# EAGLE design BaseBoard_2x5 (EAGLE 7.1.0)
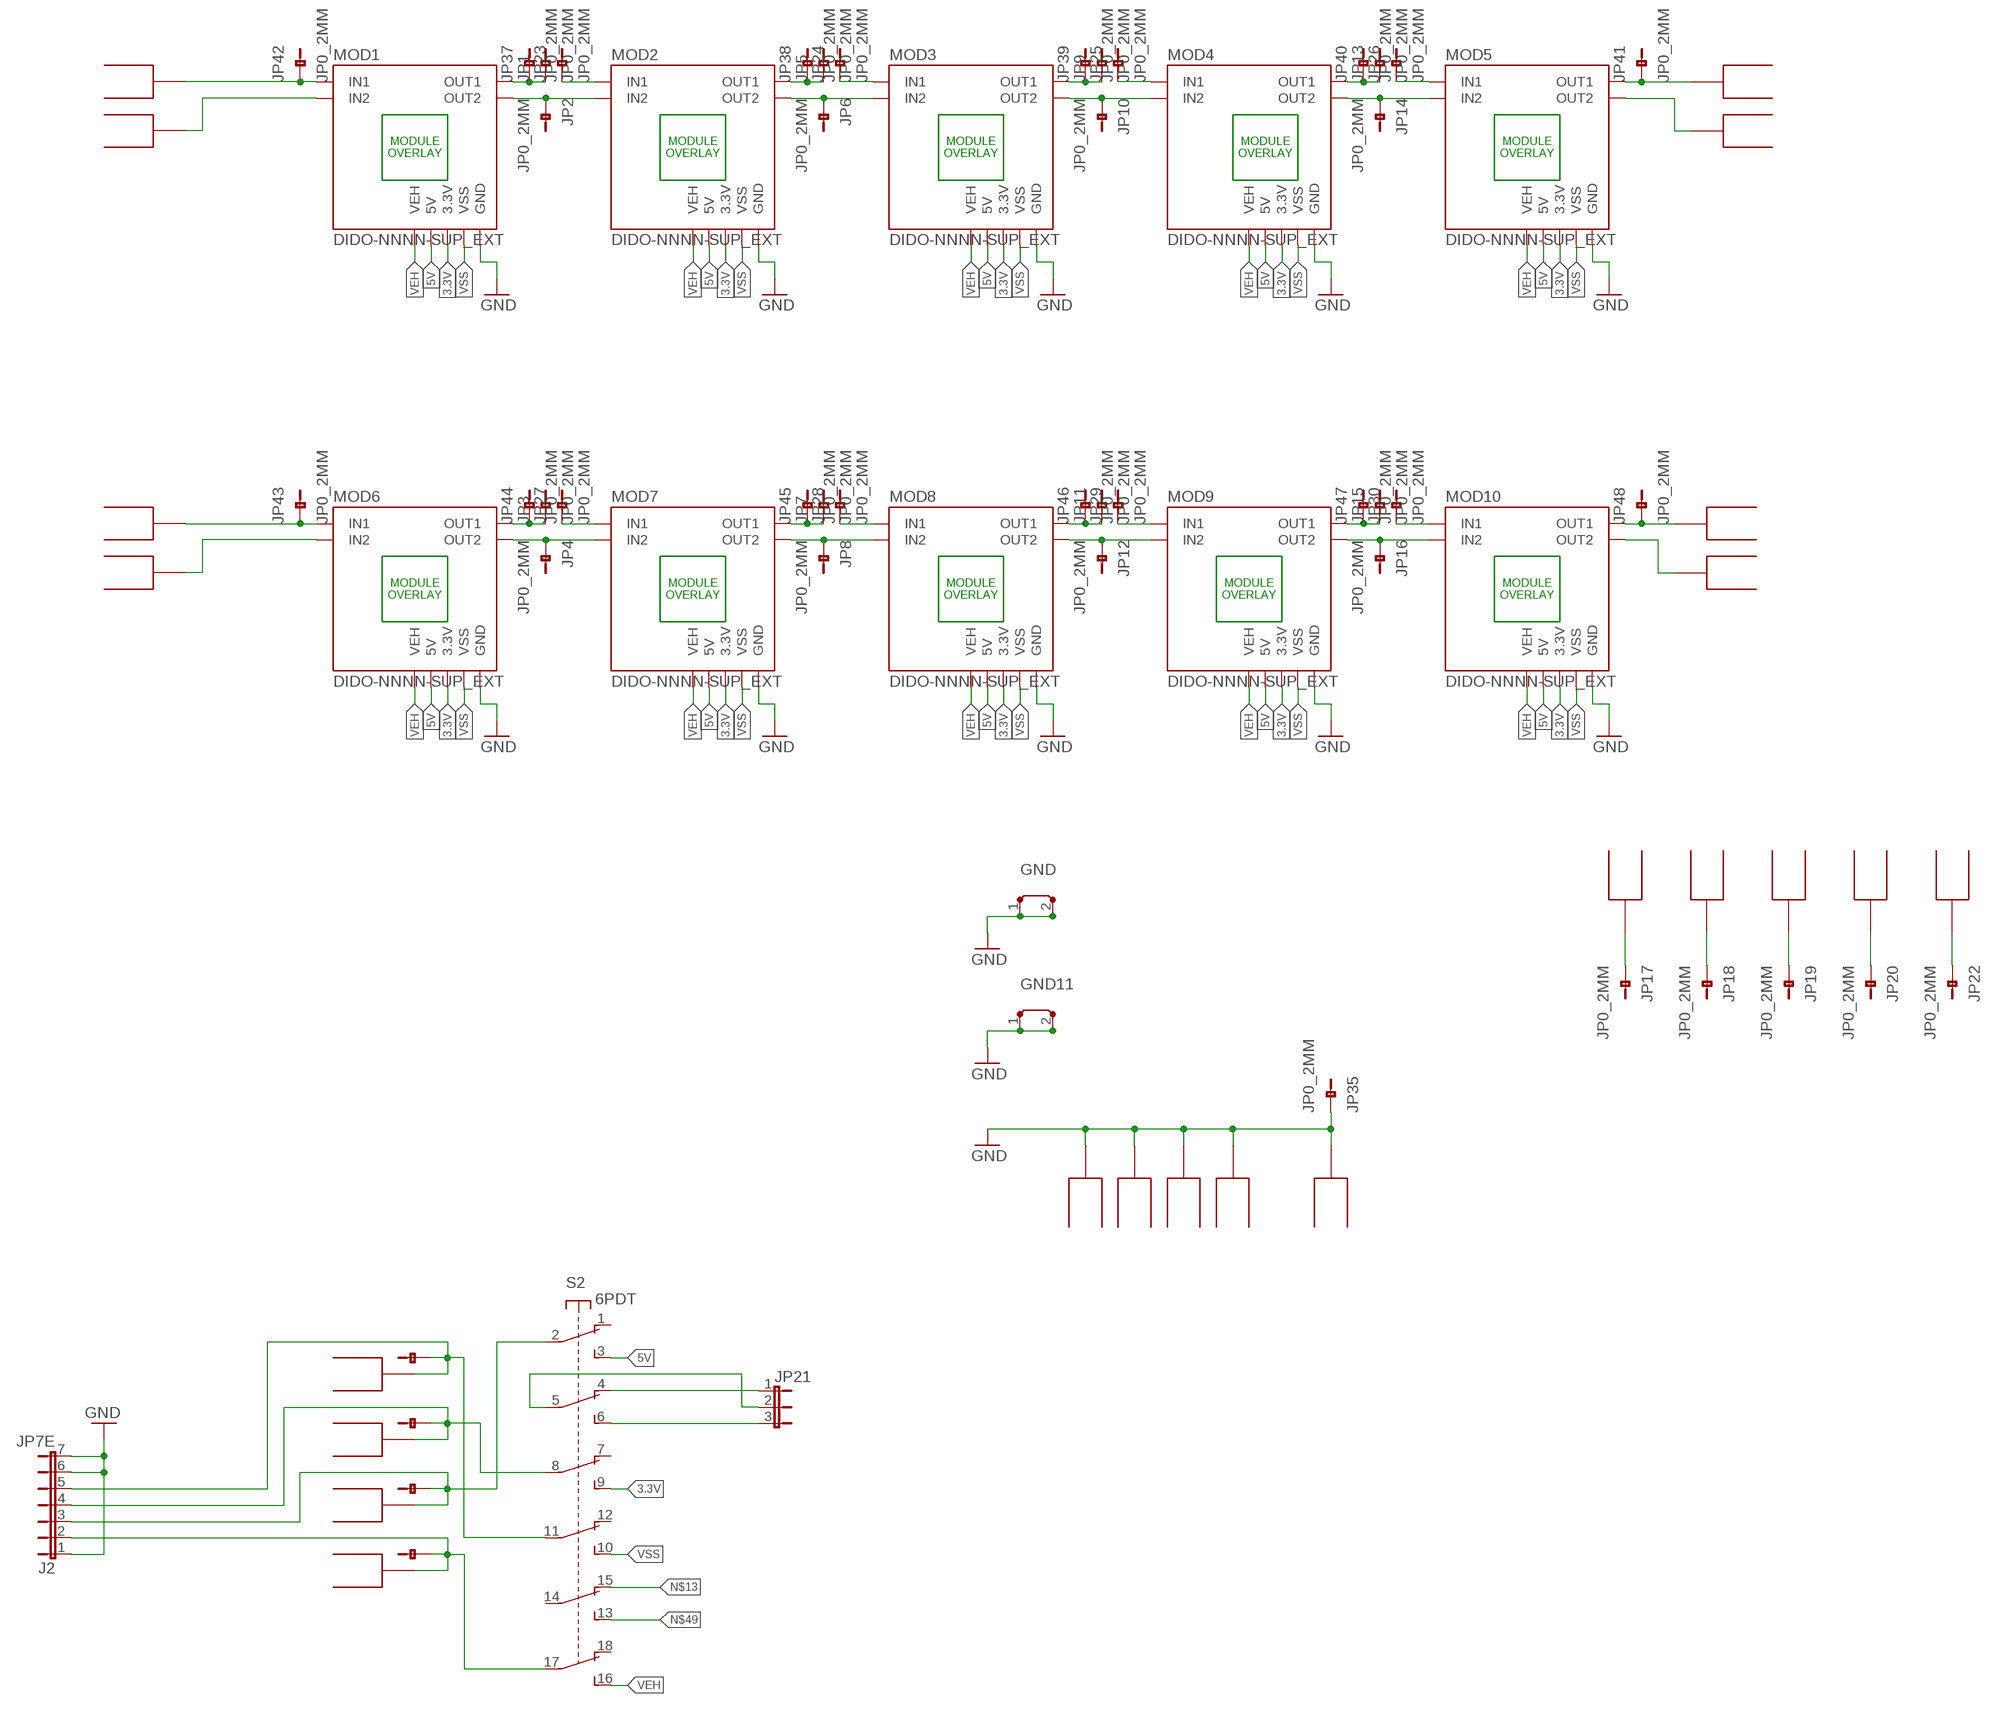
[diagram p0: schematic, sheet 1]

## Parts
GND  TE4/2  [TE4/2]
GND11  TE4/2  [TE4/2]
J2  JP7E  [JP7]
JP1  JP0_2MM  [JP0-2MM]
JP2  JP0_2MM  [JP0-2MM]
JP3  JP0_2MM  [JP0-2MM]
JP4  JP0_2MM  [JP0-2MM]
JP5  JP0_2MM  [JP0-2MM]
JP6  JP0_2MM  [JP0-2MM]
JP7  JP0_2MM  [JP0-2MM]
JP8  JP0_2MM  [JP0-2MM]
JP9  JP0_2MM  [JP0-2MM]
JP10  JP0_2MM  [JP0-2MM]
JP11  JP0_2MM  [JP0-2MM]
JP12  JP0_2MM  [JP0-2MM]
JP13  JP0_2MM  [JP0-2MM]
JP14  JP0_2MM  [JP0-2MM]
JP15  JP0_2MM  [JP0-2MM]
JP16  JP0_2MM  [JP0-2MM]
JP17  JP0_2MM  [JP0-2MM]
JP18  JP0_2MM  [JP0-2MM]
JP19  JP0_2MM  [JP0-2MM]
JP20  JP0_2MM  [JP0-2MM]
JP21  JP2E  [JP2]
JP22  JP0_2MM  [JP0-2MM]
JP23  JP0_2MM  [JP0-2MM]
JP24  JP0_2MM  [JP0-2MM]
JP25  JP0_2MM  [JP0-2MM]
JP26  JP0_2MM  [JP0-2MM]
JP27  JP0_2MM  [JP0-2MM]
JP28  JP0_2MM  [JP0-2MM]
JP29  JP0_2MM  [JP0-2MM]
JP30  JP0_2MM  [JP0-2MM]
JP35  JP0_2MM  [JP0-2MM]
JP37  JP0_2MM  [JP0-2MM]
JP38  JP0_2MM  [JP0-2MM]
JP39  JP0_2MM  [JP0-2MM]
JP40  JP0_2MM  [JP0-2MM]
JP41  JP0_2MM  [JP0-2MM]
JP42  JP0_2MM  [JP0-2MM]
JP43  JP0_2MM  [JP0-2MM]
JP44  JP0_2MM  [JP0-2MM]
JP45  JP0_2MM  [JP0-2MM]
JP46  JP0_2MM  [JP0-2MM]
JP47  JP0_2MM  [JP0-2MM]
JP48  JP0_2MM  [JP0-2MM]
JP53  JP0_2MM  [JP0-2MM]
JP54  JP0_2MM  [JP0-2MM]
JP55  JP0_2MM  [JP0-2MM]
JP56  JP0_2MM  [JP0-2MM]
MOD1  DIDO-NNNN-SUP_EXT  [DIDO-NNNN-SUP_EXT]
MOD2  DIDO-NNNN-SUP_EXT  [DIDO-NNNN-SUP_EXT]
MOD3  DIDO-NNNN-SUP_EXT  [DIDO-NNNN-SUP_EXT]
MOD4  DIDO-NNNN-SUP_EXT  [DIDO-NNNN-SUP_EXT]
MOD5  DIDO-NNNN-SUP_EXT  [DIDO-NNNN-SUP_EXT]
MOD6  DIDO-NNNN-SUP_EXT  [DIDO-NNNN-SUP_EXT]
MOD7  DIDO-NNNN-SUP_EXT  [DIDO-NNNN-SUP_EXT]
MOD8  DIDO-NNNN-SUP_EXT  [DIDO-NNNN-SUP_EXT]
MOD9  DIDO-NNNN-SUP_EXT  [DIDO-NNNN-SUP_EXT]
MOD10  DIDO-NNNN-SUP_EXT  [DIDO-NNNN-SUP_EXT]
MODULE1  MODULE_OVERLAY  [MODULE_OVERLAY]
MODULE2  MODULE_OVERLAY  [MODULE_OVERLAY]
MODULE3  MODULE_OVERLAY  [MODULE_OVERLAY]
MODULE4  MODULE_OVERLAY  [MODULE_OVERLAY]
MODULE5  MODULE_OVERLAY  [MODULE_OVERLAY]
MODULE6  MODULE_OVERLAY  [MODULE_OVERLAY]
MODULE7  MODULE_OVERLAY  [MODULE_OVERLAY]
MODULE8  MODULE_OVERLAY  [MODULE_OVERLAY]
MODULE9  MODULE_OVERLAY  [MODULE_OVERLAY]
MODULE10  MODULE_OVERLAY  [MODULE_OVERLAY]
P1  BANANA-PLUGROUND  [6MM-PAD-ROUND]
P2  BANANA-PLUGROUND  [6MM-PAD-ROUND]
P3  BANANA-PLUGROUND  [6MM-PAD-ROUND]
P4  BANANA-PLUGROUND  [6MM-PAD-ROUND]
P5  BANANA-PLUGROUND  [6MM-PAD-ROUND]
P6  BANANA-PLUGROUND  [6MM-PAD-ROUND]
P10  BANANA-PLUGROUND  [6MM-PAD-ROUND]
P11  BANANA-PLUGROUND  [6MM-PAD-ROUND]
P12  BANANA-PLUGROUND  [6MM-PAD-ROUND]
P13  BANANA-PLUGROUND  [6MM-PAD-ROUND]
P14  BANANA-PLUGROUND  [6MM-PAD-ROUND]
P15  BANANA-PLUGROUND  [6MM-PAD-ROUND]
P16  BANANA-PLUGROUND  [6MM-PAD-ROUND]
P18  BANANA-PLUGROUND  [6MM-PAD-ROUND]
P19  BANANA-PLUGROUND  [6MM-PAD-ROUND]
P20  BANANA-PLUGROUND  [6MM-PAD-ROUND]
P21  BANANA-PLUGROUND  [6MM-PAD-ROUND]
P22  BANANA-PLUGROUND  [6MM-PAD-ROUND]
P23  BANANA-PLUGROUND  [6MM-PAD-ROUND]
P24  BANANA-PLUGROUND  [6MM-PAD-ROUND]
P27  BANANA-PLUGROUND  [6MM-PAD-ROUND]
P28  BANANA-PLUGROUND  [6MM-PAD-ROUND]
S2  6PDT  [DIL18]

## Nets
3.3V: MOD1.3.3V MOD2.3.3V MOD3.3.3V MOD4.3.3V MOD5.3.3V MOD6.3.3V MOD7.3.3V MOD8.3.3V MOD9.3.3V MOD10.3.3V S2.9(S3)
5V: MOD1.5V MOD2.5V MOD3.5V MOD4.5V MOD5.5V MOD6.5V MOD7.5V MOD8.5V MOD9.5V MOD10.5V S2.3(S1)
GND: GND11.1(P) GND11.2(P) GND.1(P) GND.2(P) J2.1 J2.6 J2.7 JP35.1 MOD1.GND1(GND) MOD1.GND2(GND) MOD1.GND3(GND) MOD1.GND4(GND) MOD2.GND1(GND) MOD2.GND2(GND) MOD2.GND3(GND) MOD2.GND4(GND) MOD3.GND1(GND) MOD3.GND2(GND) MOD3.GND3(GND) MOD3.GND4(GND) MOD4.GND1(GND) MOD4.GND2(GND) MOD4.GND3(GND) MOD4.GND4(GND) MOD5.GND1(GND) MOD5.GND2(GND) MOD5.GND3(GND) MOD5.GND4(GND) MOD6.GND1(GND) MOD6.GND2(GND) MOD6.GND3(GND) MOD6.GND4(GND) MOD7.GND1(GND) MOD7.GND2(GND) MOD7.GND3(GND) MOD7.GND4(GND) MOD8.GND1(GND) MOD8.GND2(GND) MOD8.GND3(GND) MOD8.GND4(GND) MOD9.GND1(GND) MOD9.GND2(GND) MOD9.GND3(GND) MOD9.GND4(GND) MOD10.GND1(GND) MOD10.GND2(GND) MOD10.GND3(GND) MOD10.GND4(GND) P5.1 P14.1 P15.1 P16.1 P18.1
N$1: MOD5.OUT2_1(OUT2) MOD5.OUT2_2(OUT2) MOD5.OUT2_3(OUT2) MOD5.OUT2_4(OUT2) P11.1
N$2: JP42.1 MOD1.IN1 MOD1.IN2(IN1) MOD1.IN3(IN1) MOD1.IN4(IN1) P1.1
N$3: MOD10.OUT2_1(OUT2) MOD10.OUT2_2(OUT2) MOD10.OUT2_3(OUT2) MOD10.OUT2_4(OUT2) P13.1
N$4: MOD1.IN2_1(IN2) MOD1.IN2_2(IN2) MOD1.IN2_3(IN2) MOD1.IN2_4(IN2) P2.1
N$5: JP1.1 JP37.1 MOD1.OUT1 MOD1.OUT2(OUT1) MOD1.OUT3(OUT1) MOD1.OUT4(OUT1)
N$6: JP5.1 JP38.1 MOD2.OUT1 MOD2.OUT2(OUT1) MOD2.OUT3(OUT1) MOD2.OUT4(OUT1)
N$7: JP2.1 MOD1.OUT2_1(OUT2) MOD1.OUT2_2(OUT2) MOD1.OUT2_3(OUT2) MOD1.OUT2_4(OUT2) MOD2.IN2_1(IN2) MOD2.IN2_2(IN2) MOD2.IN2_3(IN2) MOD2.IN2_4(IN2)
N$8: JP17.1 P19.1
N$9: JP9.1 JP39.1 MOD3.OUT1 MOD3.OUT2(OUT1) MOD3.OUT3(OUT1) MOD3.OUT4(OUT1)
N$10: JP41.1 MOD5.OUT1 MOD5.OUT2(OUT1) MOD5.OUT3(OUT1) MOD5.OUT4(OUT1) P10.1
N$11: JP6.1 MOD2.OUT2_1(OUT2) MOD2.OUT2_2(OUT2) MOD2.OUT2_3(OUT2) MOD2.OUT2_4(OUT2) MOD3.IN2_1(IN2) MOD3.IN2_2(IN2) MOD3.IN2_3(IN2) MOD3.IN2_4(IN2)
N$12: JP18.1 P20.1
N$13: J2.3 JP54.1 P27.1 S2.2(P1) S2.15(O5)
N$14: JP23.1 MOD2.IN1 MOD2.IN2(IN1) MOD2.IN3(IN1) MOD2.IN4(IN1)
N$15: JP10.1 MOD3.OUT2_1(OUT2) MOD3.OUT2_2(OUT2) MOD3.OUT2_3(OUT2) MOD3.OUT2_4(OUT2) MOD4.IN2_1(IN2) MOD4.IN2_2(IN2) MOD4.IN2_3(IN2) MOD4.IN2_4(IN2)
N$16: JP19.1 P21.1
N$17: JP48.1 MOD10.OUT1 MOD10.OUT2(OUT1) MOD10.OUT3(OUT1) MOD10.OUT4(OUT1) P12.1
N$18: JP16.1 MOD9.OUT2_1(OUT2) MOD9.OUT2_2(OUT2) MOD9.OUT2_3(OUT2) MOD9.OUT2_4(OUT2) MOD10.IN2_1(IN2) MOD10.IN2_2(IN2) MOD10.IN2_3(IN2) MOD10.IN2_4(IN2)
N$19: JP14.1 MOD4.OUT2_1(OUT2) MOD4.OUT2_2(OUT2) MOD4.OUT2_3(OUT2) MOD4.OUT2_4(OUT2) MOD5.IN2_1(IN2) MOD5.IN2_2(IN2) MOD5.IN2_3(IN2) MOD5.IN2_4(IN2)
N$20: JP13.1 JP40.1 MOD4.OUT1 MOD4.OUT2(OUT1) MOD4.OUT3(OUT1) MOD4.OUT4(OUT1)
N$21: JP20.1 P22.1
N$22: JP21.3 S2.6(S2)
N$23: JP21.1 S2.4(O2)
N$24: JP21.2 S2.5(P2)
N$25: MOD6.IN2_1(IN2) MOD6.IN2_2(IN2) MOD6.IN2_3(IN2) MOD6.IN2_4(IN2) P4.1
N$26: JP4.1 MOD6.OUT2_1(OUT2) MOD6.OUT2_2(OUT2) MOD6.OUT2_3(OUT2) MOD6.OUT2_4(OUT2) MOD7.IN2_1(IN2) MOD7.IN2_2(IN2) MOD7.IN2_3(IN2) MOD7.IN2_4(IN2)
N$27: JP26.1 MOD5.IN1 MOD5.IN2(IN1) MOD5.IN3(IN1) MOD5.IN4(IN1)
N$28: JP22.1 P6.1
N$29: JP25.1 MOD4.IN1 MOD4.IN2(IN1) MOD4.IN3(IN1) MOD4.IN4(IN1)
N$30: JP8.1 MOD7.OUT2_1(OUT2) MOD7.OUT2_2(OUT2) MOD7.OUT2_3(OUT2) MOD7.OUT2_4(OUT2) MOD8.IN2_1(IN2) MOD8.IN2_2(IN2) MOD8.IN2_3(IN2) MOD8.IN2_4(IN2)
N$31: JP24.1 MOD3.IN1 MOD3.IN2(IN1) MOD3.IN3(IN1) MOD3.IN4(IN1)
N$32: JP12.1 MOD8.OUT2_1(OUT2) MOD8.OUT2_2(OUT2) MOD8.OUT2_3(OUT2) MOD8.OUT2_4(OUT2) MOD9.IN2_1(IN2) MOD9.IN2_2(IN2) MOD9.IN2_3(IN2) MOD9.IN2_4(IN2)
N$36: J2.2 JP53.1 P28.1 S2.17(P6)
N$39: JP27.1 MOD7.IN1 MOD7.IN2(IN1) MOD7.IN3(IN1) MOD7.IN4(IN1)
N$40: JP28.1 MOD8.IN1 MOD8.IN2(IN1) MOD8.IN3(IN1) MOD8.IN4(IN1)
N$41: JP29.1 MOD9.IN1 MOD9.IN2(IN1) MOD9.IN3(IN1) MOD9.IN4(IN1)
N$42: JP30.1 MOD10.IN1 MOD10.IN2(IN1) MOD10.IN3(IN1) MOD10.IN4(IN1)
N$43: JP43.1 MOD6.IN1 MOD6.IN2(IN1) MOD6.IN3(IN1) MOD6.IN4(IN1) P3.1
N$44: JP3.1 JP44.1 MOD6.OUT1 MOD6.OUT2(OUT1) MOD6.OUT3(OUT1) MOD6.OUT4(OUT1)
N$45: JP7.1 JP45.1 MOD7.OUT1 MOD7.OUT2(OUT1) MOD7.OUT3(OUT1) MOD7.OUT4(OUT1)
N$46: JP11.1 JP46.1 MOD8.OUT1 MOD8.OUT2(OUT1) MOD8.OUT3(OUT1) MOD8.OUT4(OUT1)
N$47: JP15.1 JP47.1 MOD9.OUT1 MOD9.OUT2(OUT1) MOD9.OUT3(OUT1) MOD9.OUT4(OUT1)
N$49: J2.4 JP55.1 P24.1 S2.8(P3) S2.13(S5)
N$50: J2.5 JP56.1 P23.1 S2.11(P4)
VEH: MOD1.VEH MOD2.VEH MOD3.VEH MOD4.VEH MOD5.VEH MOD6.VEH MOD7.VEH MOD8.VEH MOD9.VEH MOD10.VEH S2.16(S6)
VSS: MOD1.VSS MOD2.VSS MOD3.VSS MOD4.VSS MOD5.VSS MOD6.VSS MOD7.VSS MOD8.VSS MOD9.VSS MOD10.VSS S2.10(S4)
Unconnected: S2.1(O1) S2.7(O3) S2.12(O4) S2.14(P5) S2.18(O6)

## Library data of the parts
GND GND11 = busbar:TE4/2: BUS BAR 2 connections, grid 4 TE
J2 = Jumper_mod:JP7E
JP1-JP20 JP22-JP30 JP35 JP37-JP48 JP53-JP56 = Jumper_mod:JP0_2MM
JP21 = Jumper_mod:JP2E: JUMPER
MOD1-MOD10 = AllModules:DIDO-NNNN-SUP_EXT
MODULE1-MODULE10 = AllModules:MODULE_OVERLAY
P1-P6 P10-P16 P18-P24 P27 P28 = banana-plug-4mm:BANANA-PLUG
S2 = 6PDT:6PDT

## Board
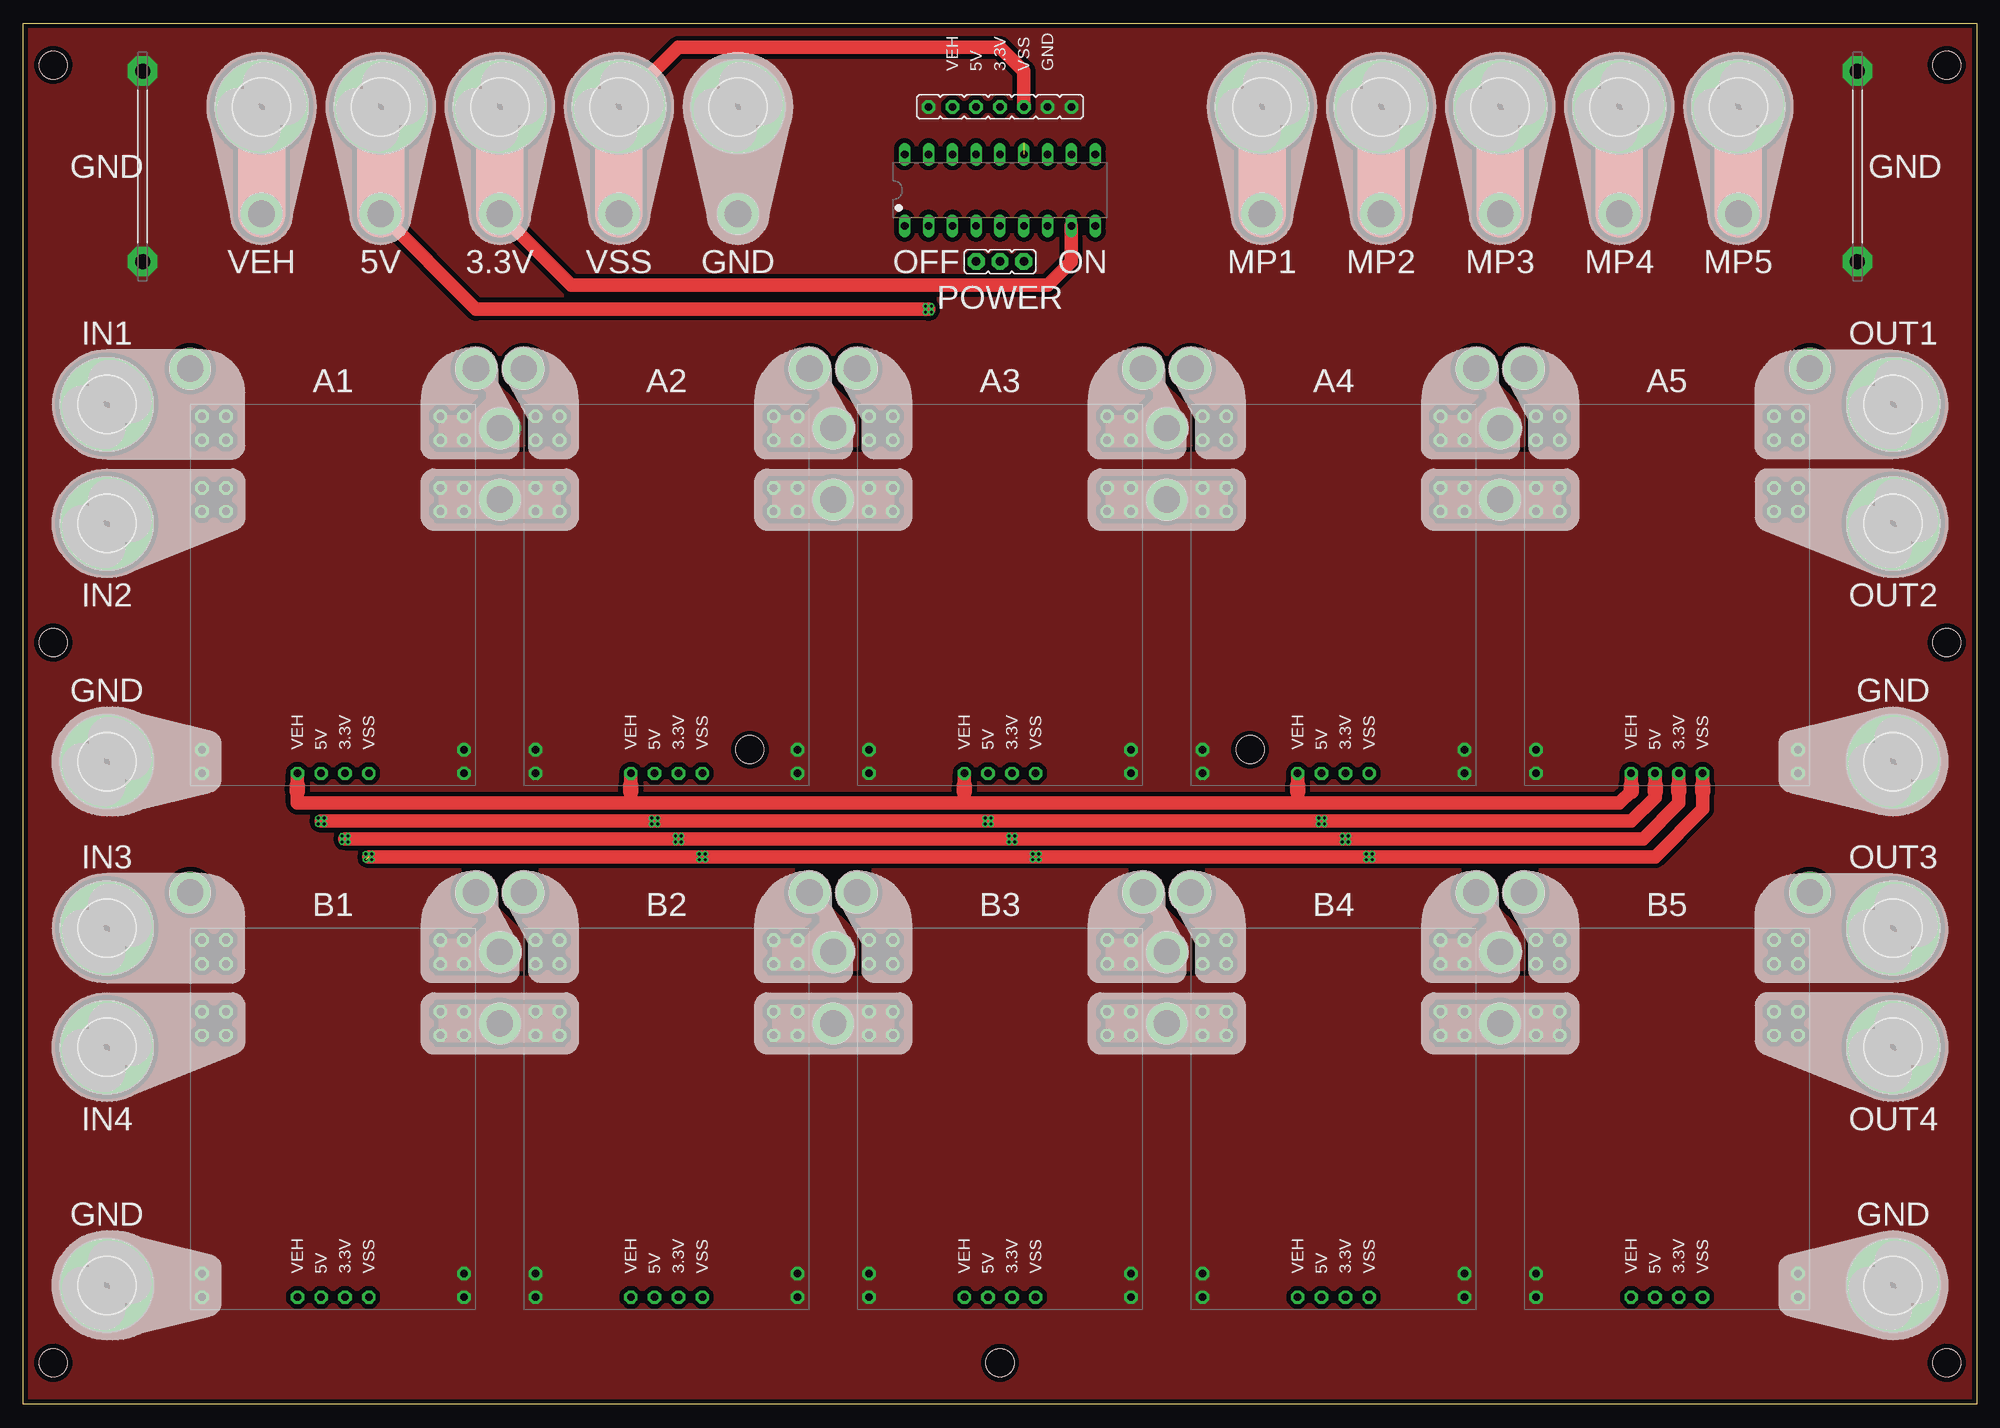
[diagram p1: board, top side]
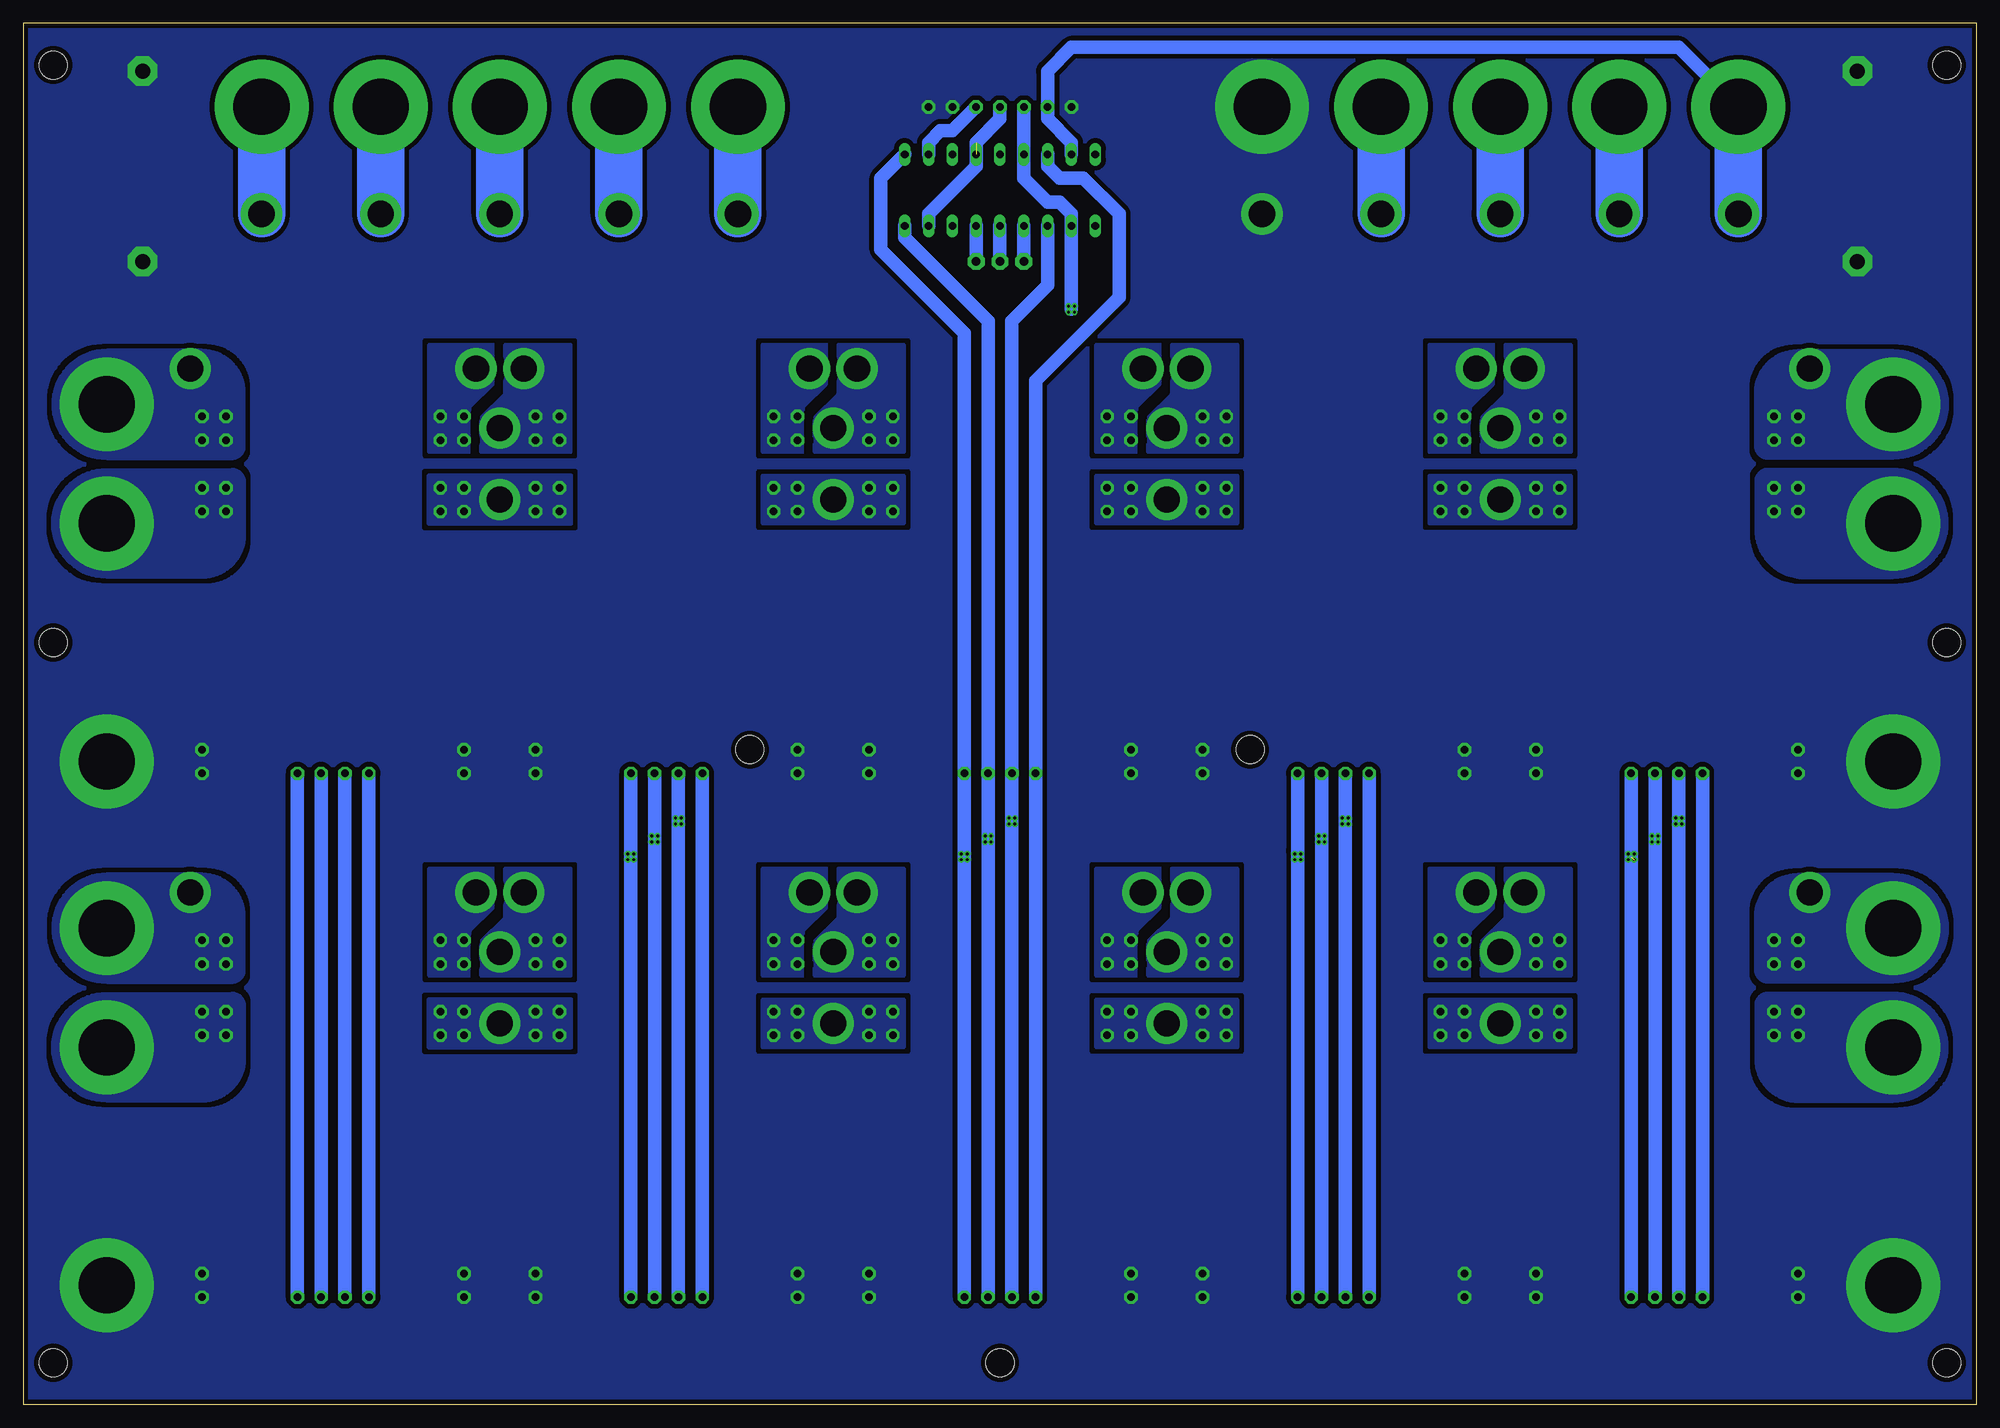
[diagram p2: board, bottom side, seen from below]

Size 208.28 x 147.32 mm. Coordinates in mm from the lower left corner, seen from the top.
Outline: 0,147.32 208.28,147.32 208.28,0 0,0 0,147.32
Copper layers (1*16): Top 0.035mm / dielectric 1.5mm / Bottom 0.035mm
Design rules "Aetzwerk-DRC 2 Lagen 35µm Cu *": minimum track width 6mil, minimum drill 12mil, track to track 6mil, track to pad 6mil, pad to pad 6mil, via to via 6mil, smd to smd 6mil, copper to edge 20mil, drill to drill 8mil, minimum pad ring 8mil, minimum via ring 6mil, stop-mask expansion 3mil, vias tented up to drill 20mil, thermal gap 8mil
Holes 3 mm at 3.17,142.88 205.1,142.88 3.17,4.44 205.1,4.44 77.47,69.85 130.81,69.85 205.1,81.28 3.17,81.28 104.14,4.44

### Footprints (pad centres in the part's own frame; a part is rotated, then mirrored left to right if it is on the bottom)
TE4/2 = drill 1.6 pad 3.15 octagon: 1 -10.16,0; 2 10.16,0
JP7 = drill 0.8 pad 1.44 octagon: 1 -5.08,0; 2 -2.54,0; 3 0,0; 4 2.54,0; 5 5.08,0; 6 7.62,0; 7 10.16,0
JP0-2MM = drill 2.8 pad 4.4: 1 0,0
JP2 = drill 0.914 pad 1.778 octagon: 1 -2.54,0; 2 0,0; 3 2.54,0
DIDO-NNNN-SUP_EXT = drill 0.8 pad 1.422 octagon: 3.3V 15.24,-38.1; 5V 12.7,-38.1; GND1 0,-38.1; GND2 0,-35.56; GND3 27.94,-35.56; GND4 27.94,-38.1; IN1 0,0; IN2 0,-2.54; IN2_1 0,-7.62; IN2_2 0,-10.16; IN2_3 2.54,-7.62; IN2_4 2.54,-10.16; IN3 2.54,0; IN4 2.54,-2.54; OUT1 25.4,0; OUT2 25.4,-2.54; OUT2_1 25.4,-7.62; OUT2_2 25.4,-10.16; OUT2_3 27.94,-7.62; OUT2_4 27.94,-10.16; OUT3 27.94,0; OUT4 27.94,-2.54; VEH 10.16,-38.1; VSS 17.78,-38.1
6MM-PAD-ROUND = drill 6 pad 10: 1 0,0
DIL18 = drill 0.813 long: 1 -10.16,-3.81; 2 -7.62,-3.81; 3 -5.08,-3.81; 4 -2.54,-3.81; 5 0,-3.81; 6 2.54,-3.81; 7 5.08,-3.81; 8 7.62,-3.81; 9 10.16,-3.81; 10 10.16,3.81; 11 7.62,3.81; 12 5.08,3.81; 13 2.54,3.81; 14 0,3.81; 15 -2.54,3.81; 16 -5.08,3.81; 17 -7.62,3.81; 18 -10.16,3.81

### Placement (x,y rotation side)
GND  195.58,132.08 90 top
GND11  12.7,132.08 90 top
J2  101.6,138.43 0 top
JP1  48.26,110.49 270 top
JP2  50.8,96.52 0 top
JP3  48.26,54.61 270 top
JP4  50.8,40.64 0 top
JP5  83.82,110.49 270 top
JP6  86.36,96.52 0 top
JP7  83.82,54.61 270 top
JP8  86.36,40.64 0 top
JP9  119.38,110.49 270 top
JP10  121.92,96.52 0 top
JP11  119.38,54.61 270 top
JP12  121.92,40.64 0 top
JP13  154.94,110.49 270 top
JP14  157.48,96.52 0 top
JP15  154.94,54.61 270 top
JP16  157.48,40.64 0 top
JP17  132.08,127 0 top
JP18  144.78,127 0 top
JP19  157.48,127 0 top
JP20  170.18,127 0 top
JP21  104.14,121.92 0 top
JP22  182.88,127 0 top
JP23  53.34,110.49 270 top
JP24  88.9,110.49 270 top
JP25  124.46,110.49 270 top
JP26  160.02,110.49 270 top
JP27  53.34,54.61 270 top
JP28  88.9,54.61 270 top
JP29  124.46,54.61 270 top
JP30  160.02,54.61 270 top
JP35  76.2,127 90 top
JP37  50.8,104.14 0 top
JP38  86.36,104.14 0 top
JP39  121.92,104.14 0 top
JP40  157.48,104.14 0 top
JP41  190.5,110.49 0 top
JP42  17.78,110.49 0 top
JP43  17.78,54.61 0 top
JP44  50.8,48.26 0 top
JP45  86.36,48.26 0 top
JP46  121.92,48.26 0 top
JP47  157.48,48.26 0 top
JP48  190.5,54.61 0 top
JP53  25.4,127 0 top
JP54  38.1,127 0 top
JP55  50.8,127 0 top
JP56  63.5,127 0 top
MOD1  19.05,105.41 0 top
MOD2  54.61,105.41 0 top
MOD3  90.17,105.41 0 top
MOD4  125.73,105.41 0 top
MOD5  161.29,105.41 0 top
MOD6  19.05,49.53 0 top
MOD7  54.61,49.53 0 top
MOD8  90.17,49.53 0 top
MOD9  125.73,49.53 0 top
MOD10  161.29,49.53 0 top
MODULE1  19.05,105.41 0 top
MODULE2  54.61,105.41 0 top
MODULE3  90.17,105.41 0 top
MODULE4  125.73,105.41 0 top
MODULE5  161.29,105.41 0 top
MODULE6  19.05,49.53 0 top
MODULE7  54.61,49.53 0 top
MODULE8  90.17,49.53 0 top
MODULE9  125.73,49.53 0 top
MODULE10  161.29,49.53 0 top
P1  8.89,106.68 0 top
P2  8.89,93.98 0 top
P3  8.89,50.8 0 top
P4  8.89,38.1 0 top
P5  199.39,12.7 0 top
P6  182.88,138.43 0 top
P10  199.39,106.68 0 top
P11  199.39,93.98 0 top
P12  199.39,50.8 0 top
P13  199.39,38.1 0 top
P14  8.89,68.58 0 top
P15  8.89,12.7 0 top
P16  199.39,68.58 0 top
P18  76.2,138.43 0 top
P19  132.08,138.43 0 top
P20  144.78,138.43 0 top
P21  157.48,138.43 0 top
P22  170.18,138.43 0 top
P23  63.5,138.43 0 top
P24  50.8,138.43 0 top
P27  38.1,138.43 0 top
P28  25.4,138.43 0 top
S2  104.14,129.54 0 top

### Tracks (layer width: path | path; a pad name or v marks a point on that pad's centre or on a via)
3.3V  (via drill 0.3)
  Top 0.406: v34.61,60.01 34.29,60.32 | v141.29,60.01 140.97,60.32 | v105.73,60.01 105.41,60.32 | v70.17,60.01 69.85,60.32 | v69.53,60.01 69.85,60.01 70.17,60.32
  Top 1.422: 34.29,60.32 70.17,60.32 105.41,60.32 140.97,60.32 172.72,60.32 176.53,64.13 176.53,65.4 | 176.53,66.04 MOD5.3.3V
  Top 1.676: 176.53,65.4 176.53,66.04
  Bottom 0.406: 34.29,60.96 v33.97,60.64 | v33.97,60.64 v34.61,60.64 v34.61,60.01 | v33.97,60.01 v33.97,60.64 | 140.97,60.96 v140.65,60.64 | v140.65,60.64 v141.29,60.64 | v140.65,60.01 v140.65,60.64 | 105.41,60.96 v105.09,60.64 | v105.09,60.64 v105.73,60.64 | v105.09,60.01 v105.09,60.64 | v105.73,60.64 105.41,60.32 | v105.73,60.01 v105.73,60.64 | v141.29,60.64 140.97,60.32 | v141.29,60.01 v141.29,60.64 | 69.85,60.96 v69.53,60.64 | v69.53,60.64 v70.17,60.64 v70.17,60.01 | v69.53,60.01 v69.53,60.64
  Bottom 1.422: MOD5.3.3V MOD10.3.3V | MOD6.3.3V 34.29,60.96 MOD1.3.3V | MOD8.3.3V 105.41,60.32 105.41,60.96 MOD3.3.3V 105.41,115.57 114.3,124.46 S2.9 | MOD2.3.3V 69.85,60.96 MOD7.3.3V | MOD4.3.3V 140.97,60.32 MOD9.3.3V
5V  (via drill 0.3)
  Top 0.406: v138.75,61.91 138.43,62.23 v138.11,61.91 138.43,61.91 | v103.19,61.91 102.87,62.23 | 67.31,62.23 v67.63,61.91 67.63,62.23 | v102.55,62.55 102.87,62.55 103.19,62.23 | v32.07,61.91 31.75,62.23
  Top 1.422: 31.75,62.23 67.63,62.23 103.19,62.23 138.43,62.23 171.45,62.23 173.99,64.77 173.99,65.4 | MOD5.5V 173.99,66.04
  Top 1.676: 173.99,66.04 173.99,65.4
  Bottom 0.406: 138.43,62.86 v138.11,62.55 | v138.11,62.55 138.43,62.55 v138.75,62.55 v138.75,61.91 | 102.87,62.86 v102.55,62.55 | v102.55,62.55 v103.19,62.55 v103.19,61.91 102.87,62.23 | v102.55,62.55 v102.55,61.91 102.87,62.23 | 67.31,62.86 v66.99,62.55 | v66.99,62.55 v67.63,62.55 v67.63,61.91 | v66.99,61.91 v66.99,62.55 | v102.55,62.55 102.87,62.23 | v138.11,61.91 v138.11,62.55 | 31.75,62.86 v31.43,62.55 | v31.43,62.55 v32.07,62.55 v32.07,61.91 | v31.43,61.91 v31.43,62.55
  Bottom 1.422: MOD1.5V 31.75,62.86 MOD6.5V | MOD5.5V MOD10.5V | MOD8.5V 102.87,62.23 102.87,62.86 MOD3.5V 102.87,115.57 99.06,119.38 S2.3 | MOD2.5V 67.31,62.86 MOD7.5V | MOD4.5V 138.43,62.86 138.43,62.55 MOD9.5V
GND
  pour Bottom (isolate 0.508, rank 3, no thermals): -1.27,148.59 209.53,148.59 209.55,-1.27 -1.27,-1.27
  pour Top (isolate 0.508, rank 3, no thermals): -2.54,149.86 210.82,149.86 210.82,-2.54 -2.54,-2.54
N$1
  pour Bottom (no thermals): 184.78,98.42 184.78,92.71 arc90 189.23,88.26 199.39,88.26 arc90 205.1,93.98 arc90 199.39,99.69 186.06,99.69 arc90
N$2
  pour Bottom (no thermals): 23.5,102.23 23.5,107.95 arc90 19.05,112.39 8.89,112.39 arc90 3.17,106.68 arc90 8.89,100.97 22.23,100.97 arc90
N$3
  pour Bottom (no thermals): 184.78,42.54 184.78,36.83 arc90 189.23,32.38 199.39,32.38 arc90 205.1,38.1 arc90 199.39,43.81 186.06,43.81 arc90
N$4
  pour Bottom (no thermals): 3.17,93.98 arc-90 8.89,99.69 22.23,99.69 arc-90 23.5,98.42 23.5,93.34 arc-90 18.41,88.26 8.89,88.26 arc-90
N$5
  pour Bottom (isolate 0.914, no thermals): 43.18,113.03 50.32,113.03 50.32,107.79 52.86,105.25 52.86,101.6 43.18,101.6
  pour Top (no thermals): 44.45,105.41 47.62,105.41 49.53,107.31 49.53,107.95 48.26,109.22 46.99,109.22 46.99,111.76 49.53,111.76 49.53,109.85 53.34,106.04 53.34,102.23 44.45,102.23
N$6
  pour Bottom (isolate 0.914, no thermals): 78.74,113.03 85.88,113.03 85.88,107.79 88.42,105.25 88.42,101.6 78.74,101.6
  pour Top (no thermals): 80.01,105.41 83.19,105.41 85.09,107.31 85.09,107.95 83.82,109.22 82.55,109.22 82.55,111.76 85.09,111.76 85.09,109.85 88.9,106.04 88.9,102.23 80.01,102.23
N$7
  pour Bottom (no thermals): 43.18,99.06 58.42,99.06 58.42,93.98 43.18,93.98
  pour Top (no thermals): 44.45,98.42 57.15,98.42 57.15,94.61 44.45,94.61
N$8
  Top 5.08: P19.1 JP17.1
  Bottom 5.08: JP17.1 P19.1
N$9
  pour Bottom (isolate 0.914, no thermals): 114.3,113.03 121.44,113.03 121.44,107.79 123.98,105.25 123.98,101.6 114.3,101.6
  pour Top (no thermals): 115.57,105.41 118.75,105.41 120.65,107.31 120.65,107.95 119.38,109.22 118.11,109.22 118.11,111.76 120.65,111.76 120.65,109.85 124.46,106.04 124.46,102.23 115.57,102.23
N$10
  pour Bottom (no thermals): 184.78,102.23 184.78,107.95 arc-90 189.23,112.39 199.39,112.39 arc-90 205.1,106.68 arc-90 199.39,100.97 186.06,100.97 arc-90
N$11
  pour Bottom (no thermals): 78.74,99.06 93.98,99.06 93.98,93.98 78.74,93.98
  pour Top (no thermals): 80.01,98.42 92.71,98.42 92.71,94.61 80.01,94.61
N$12
  Top 5.08: P20.1 JP18.1
  Bottom 5.08: JP18.1 P20.1
N$13  (via drill 0.3)
  Top 0.406: v96.2,117.16 v96.84,117.16 96.84,116.84 96.52,116.84 96.52,116.52 v96.84,116.52
  Top 1.422: 96.52,116.84 48.26,116.84 JP54.1
  Top 5.08: JP54.1 P27.1
  Bottom 0.406: v96.2,116.52 v96.84,116.52 v96.84,117.16 | 96.52,116.84 96.2,116.84 v96.2,117.16
  Bottom 1.422: J2.3 S2.15 101.6,130.81 99.06,128.27 97.79,128.27 96.52,127 S2.2 96.52,116.84
  Bottom 5.08: P27.1 JP54.1
N$14
  pour Bottom (isolate 0.914, rank 2, no thermals): 53.66,101.6 53.66,105.41 51.12,107.95 51.12,113.03 58.42,113.03 58.42,101.6
N$15
  pour Bottom (no thermals): 114.3,99.06 129.54,99.06 129.54,93.98 114.3,93.98
  pour Top (no thermals): 115.57,98.42 128.27,98.42 128.27,94.61 115.57,94.61
N$16
  Top 5.08: P21.1 JP19.1
  Bottom 5.08: JP19.1 P21.1
N$17
  pour Bottom (no thermals): 184.78,46.35 184.78,52.07 arc-90 189.23,56.51 199.39,56.51 arc-90 205.1,50.8 arc-90 199.39,45.08 186.06,45.08 arc-90
N$18
  pour Bottom (no thermals): 149.86,43.18 165.1,43.18 165.1,38.1 149.86,38.1
  pour Top (no thermals): 151.13,42.54 163.83,42.54 163.83,38.73 151.13,38.73
N$19
  pour Bottom (no thermals): 149.86,99.06 165.1,99.06 165.1,93.98 149.86,93.98
  pour Top (no thermals): 151.13,98.42 163.83,98.42 163.83,94.61 151.13,94.61
N$20
  pour Bottom (isolate 0.914, no thermals): 149.86,113.03 157,113.03 157,107.79 159.54,105.25 159.54,101.6 149.86,101.6
  pour Top (no thermals): 151.13,105.41 154.31,105.41 156.21,107.31 156.21,107.95 154.94,109.22 153.67,109.22 153.67,111.76 156.21,111.76 156.21,109.85 160.02,106.04 160.02,102.23 151.13,102.23
N$21
  Top 5.08: P22.1 JP20.1
  Bottom 5.08: JP20.1 P22.1
N$22
  Bottom 1.422: JP21.3 S2.6
N$23
  Bottom 1.422: JP21.1 S2.4
N$24
  Bottom 1.422: JP21.2 S2.5
N$25
  pour Bottom (no thermals): 3.17,38.1 arc-90 8.89,43.81 22.23,43.81 arc-90 23.5,42.54 23.5,36.83 arc-90 19.05,32.38 8.89,32.38 arc-90
N$26
  pour Bottom (no thermals): 43.18,43.18 58.42,43.18 58.42,38.1 43.18,38.1
  pour Top (no thermals): 44.45,42.54 57.15,42.54 57.15,38.73 44.45,38.73
N$27
  pour Bottom (isolate 0.914, rank 2, no thermals): 160.34,101.6 160.34,105.41 157.8,107.95 157.8,113.03 165.1,113.03 165.1,101.6
N$28
  Top 5.08: P6.1 JP22.1
  Bottom 5.08: JP22.1 P6.1
N$29
  pour Bottom (isolate 0.914, rank 2, no thermals): 124.78,101.6 124.78,105.41 122.24,107.95 122.24,113.03 129.54,113.03 129.54,101.6
N$30
  pour Bottom (no thermals): 78.74,43.18 93.98,43.18 93.98,38.1 78.74,38.1
  pour Top (no thermals): 80.01,42.54 92.71,42.54 92.71,38.73 80.01,38.73
N$31
  pour Bottom (isolate 0.914, rank 2, no thermals): 89.22,101.6 89.22,105.41 86.68,107.95 86.68,113.03 93.98,113.03 93.98,101.6
N$32
  pour Bottom (no thermals): 114.3,43.18 129.54,43.18 129.54,38.1 114.3,38.1
  pour Top (no thermals): 115.57,42.54 128.27,42.54 128.27,38.73 115.57,38.73
N$36
  Top 5.08: JP53.1 P28.1
  Bottom 1.422: P28.1 31.75,144.78 96.52,144.78 99.06,142.24 J2.2 99.06,137.16 96.52,134.62 S2.17
  Bottom 5.08: P28.1 JP53.1
N$39
  pour Bottom (isolate 0.914, rank 2, no thermals): 53.66,45.72 53.66,49.53 51.12,52.07 51.12,57.15 58.42,57.15 58.42,45.72
N$40
  pour Bottom (isolate 0.914, rank 2, no thermals): 89.22,45.72 89.22,49.53 86.68,52.07 86.68,57.15 93.98,57.15 93.98,45.72
N$41
  pour Bottom (isolate 0.914, rank 2, no thermals): 124.78,45.72 124.78,49.53 122.24,52.07 122.24,57.15 129.54,57.15 129.54,45.72
N$42
  pour Bottom (isolate 0.914, rank 2, no thermals): 160.34,45.72 160.34,49.53 157.8,52.07 157.8,57.15 165.1,57.15 165.1,45.72
N$43
  pour Bottom (no thermals): 23.5,46.35 23.5,52.07 arc90 19.05,56.51 8.89,56.51 arc90 3.17,50.8 arc90 8.89,45.08 22.23,45.08 arc90
N$44
  pour Bottom (isolate 0.914, no thermals): 43.18,57.15 50.32,57.15 50.32,51.91 52.86,49.37 52.86,45.72 43.18,45.72
  pour Top (no thermals): 44.45,49.53 47.62,49.53 49.53,51.43 49.53,52.07 48.26,53.34 46.99,53.34 46.99,55.88 49.53,55.88 49.53,53.97 53.34,50.16 53.34,46.35 44.45,46.35
N$45
  pour Bottom (isolate 0.914, no thermals): 78.74,57.15 85.88,57.15 85.88,51.91 88.42,49.37 88.42,45.72 78.74,45.72
  pour Top (no thermals): 80.01,49.53 83.19,49.53 85.09,51.43 85.09,52.07 83.82,53.34 82.55,53.34 82.55,55.88 85.09,55.88 85.09,53.97 88.9,50.16 88.9,46.35 80.01,46.35
N$46
  pour Bottom (isolate 0.914, no thermals): 114.3,57.15 121.44,57.15 121.44,51.91 123.98,49.37 123.98,45.72 114.3,45.72
  pour Top (no thermals): 115.57,49.53 118.75,49.53 120.65,51.43 120.65,52.07 119.38,53.34 118.11,53.34 118.11,55.88 120.65,55.88 120.65,53.97 124.46,50.16 124.46,46.35 115.57,46.35
N$47
  pour Bottom (isolate 0.914, no thermals): 149.86,57.15 157,57.15 157,51.91 159.54,49.37 159.54,45.72 149.86,45.72
  pour Top (no thermals): 151.13,49.53 154.31,49.53 156.21,51.43 156.21,52.07 154.94,53.34 153.67,53.34 153.67,55.88 156.21,55.88 156.21,53.97 160.02,50.16 160.02,46.35 151.13,46.35
N$49  (1 unrouted)
  Top 1.422: JP55.1 58.42,119.38 109.22,119.38 111.76,121.92 S2.8
  Top 5.08: JP55.1 P24.1
  Bottom 1.422: S2.8 111.76,127 106.68,132.08 106.68,134.62 104.14,137.16 J2.4
  Bottom 5.08: P24.1 JP55.1
N$50
  Top 1.422: P23.1 69.85,144.78 104.14,144.78 106.68,142.24 J2.5
  Top 5.08: JP56.1 P23.1
  Bottom 1.422: J2.5 109.22,135.89 110.49,135.89 111.76,134.62 S2.11
  Bottom 5.08: P23.1 JP56.1
VEH
  Top 1.422: 64.77,64.13 29.21,64.13 29.21,65.4 | 64.77,64.13 100.33,64.13 | 100.33,64.13 135.89,64.13 | 135.89,64.13 170.18,64.13 171.45,65.4 | 29.21,66.04 MOD1.VEH | 171.45,66.04 MOD5.VEH | 135.89,64.13 135.89,65.4 | 135.89,66.04 MOD4.VEH | 100.33,64.13 100.33,65.4 | 100.33,66.04 MOD3.VEH | 64.77,64.13 64.77,65.4 | 64.77,66.04 MOD2.VEH
  Top 1.676: 29.21,65.4 29.21,66.04 | 171.45,65.4 171.45,66.04 | 135.89,65.4 135.89,66.04 | 100.33,65.4 100.33,66.04 | 64.77,65.4 64.77,66.04
  Bottom 1.422: MOD6.VEH MOD1.VEH | MOD10.VEH MOD5.VEH | MOD8.VEH MOD3.VEH 100.33,109.22 91.44,118.11 91.44,127 95.25,130.81 97.79,130.81 99.06,132.08 S2.16 | MOD2.VEH MOD7.VEH | MOD4.VEH MOD9.VEH
VSS  (via drill 0.3)  (1 unrouted)
  Top 0.406: 36.83,58.42 37.15,58.42 v37.15,58.1 | 143.51,58.42 v143.83,58.1 143.83,58.42 | v108.27,58.1 107.95,58.42 v108.27,58.74 | v72.71,58.1 72.39,58.42
  Top 1.422: 36.83,58.42 72.39,58.42 107.95,58.42 143.83,58.42 173.99,58.42 179.07,63.5 179.07,65.4 | 179.07,66.04 MOD5.VSS
  Top 1.676: 179.07,65.4 179.07,66.04
  Bottom 0.406: 36.83,59.37 36.51,59.37 v36.51,58.74 v37.15,58.74 v37.15,58.1 | 143.51,59.05 v143.19,58.74 | v143.19,58.74 v143.83,58.74 v143.83,58.1 | v143.19,58.1 v143.19,58.74 | 107.95,59.05 v107.63,58.74 | v107.63,58.74 v108.27,58.74 v108.27,58.1 | v107.63,58.1 v107.63,58.74 | 72.39,59.05 v72.07,58.74 | v72.07,58.74 v72.71,58.74 v72.71,58.1 | v72.07,58.1 v72.07,58.74
  Bottom 1.422: MOD10.VSS MOD5.VSS | MOD9.VSS 143.51,59.05 MOD4.VSS | MOD8.VSS 107.95,59.05 MOD3.VSS 107.95,114.3 116.84,123.19 116.84,130.81 S2.10 | MOD2.VSS 72.39,59.05 MOD7.VSS | MOD6.VSS 36.83,59.37 MOD1.VSS
  other vias: 36.51,58.1

### Text on the board
tNames: VEH | 5V | 3.3V | VSS | GND | GND | GND | VEH | 5V | 3.3V | VSS | GND | OFF | ON | MP1 | MP2 | MP3 | MP4 | MP5 | POWER | IN1 | OUT1 | A1 | A2 | A3 | A4 | A5 | IN2 | OUT2 | GND | GND | IN3 | OUT3 | B1 | B2 | B3 | B4 | B5 | IN4 | OUT4 | GND | GND
tStop: M | E | D | ley | - the Micro Energy Development Kit
bStop: Professur EMP, IMTEK, Uni Freiburg / J. Kokert & T. Beckedahl 11/2016